# EasyEDA Pro project ProPrj_STC8H8K64U开发板_2024-06-28.epro

# Schematic Schematic1
Create Date: 2023-01-15; Page Name: P1; Project Name: STC8H8K64U; Schematic Name: Schematic1; Update Date: 2023-02-03; Company: 嘉立创EDA; Page Size: A3; Version: V1.0
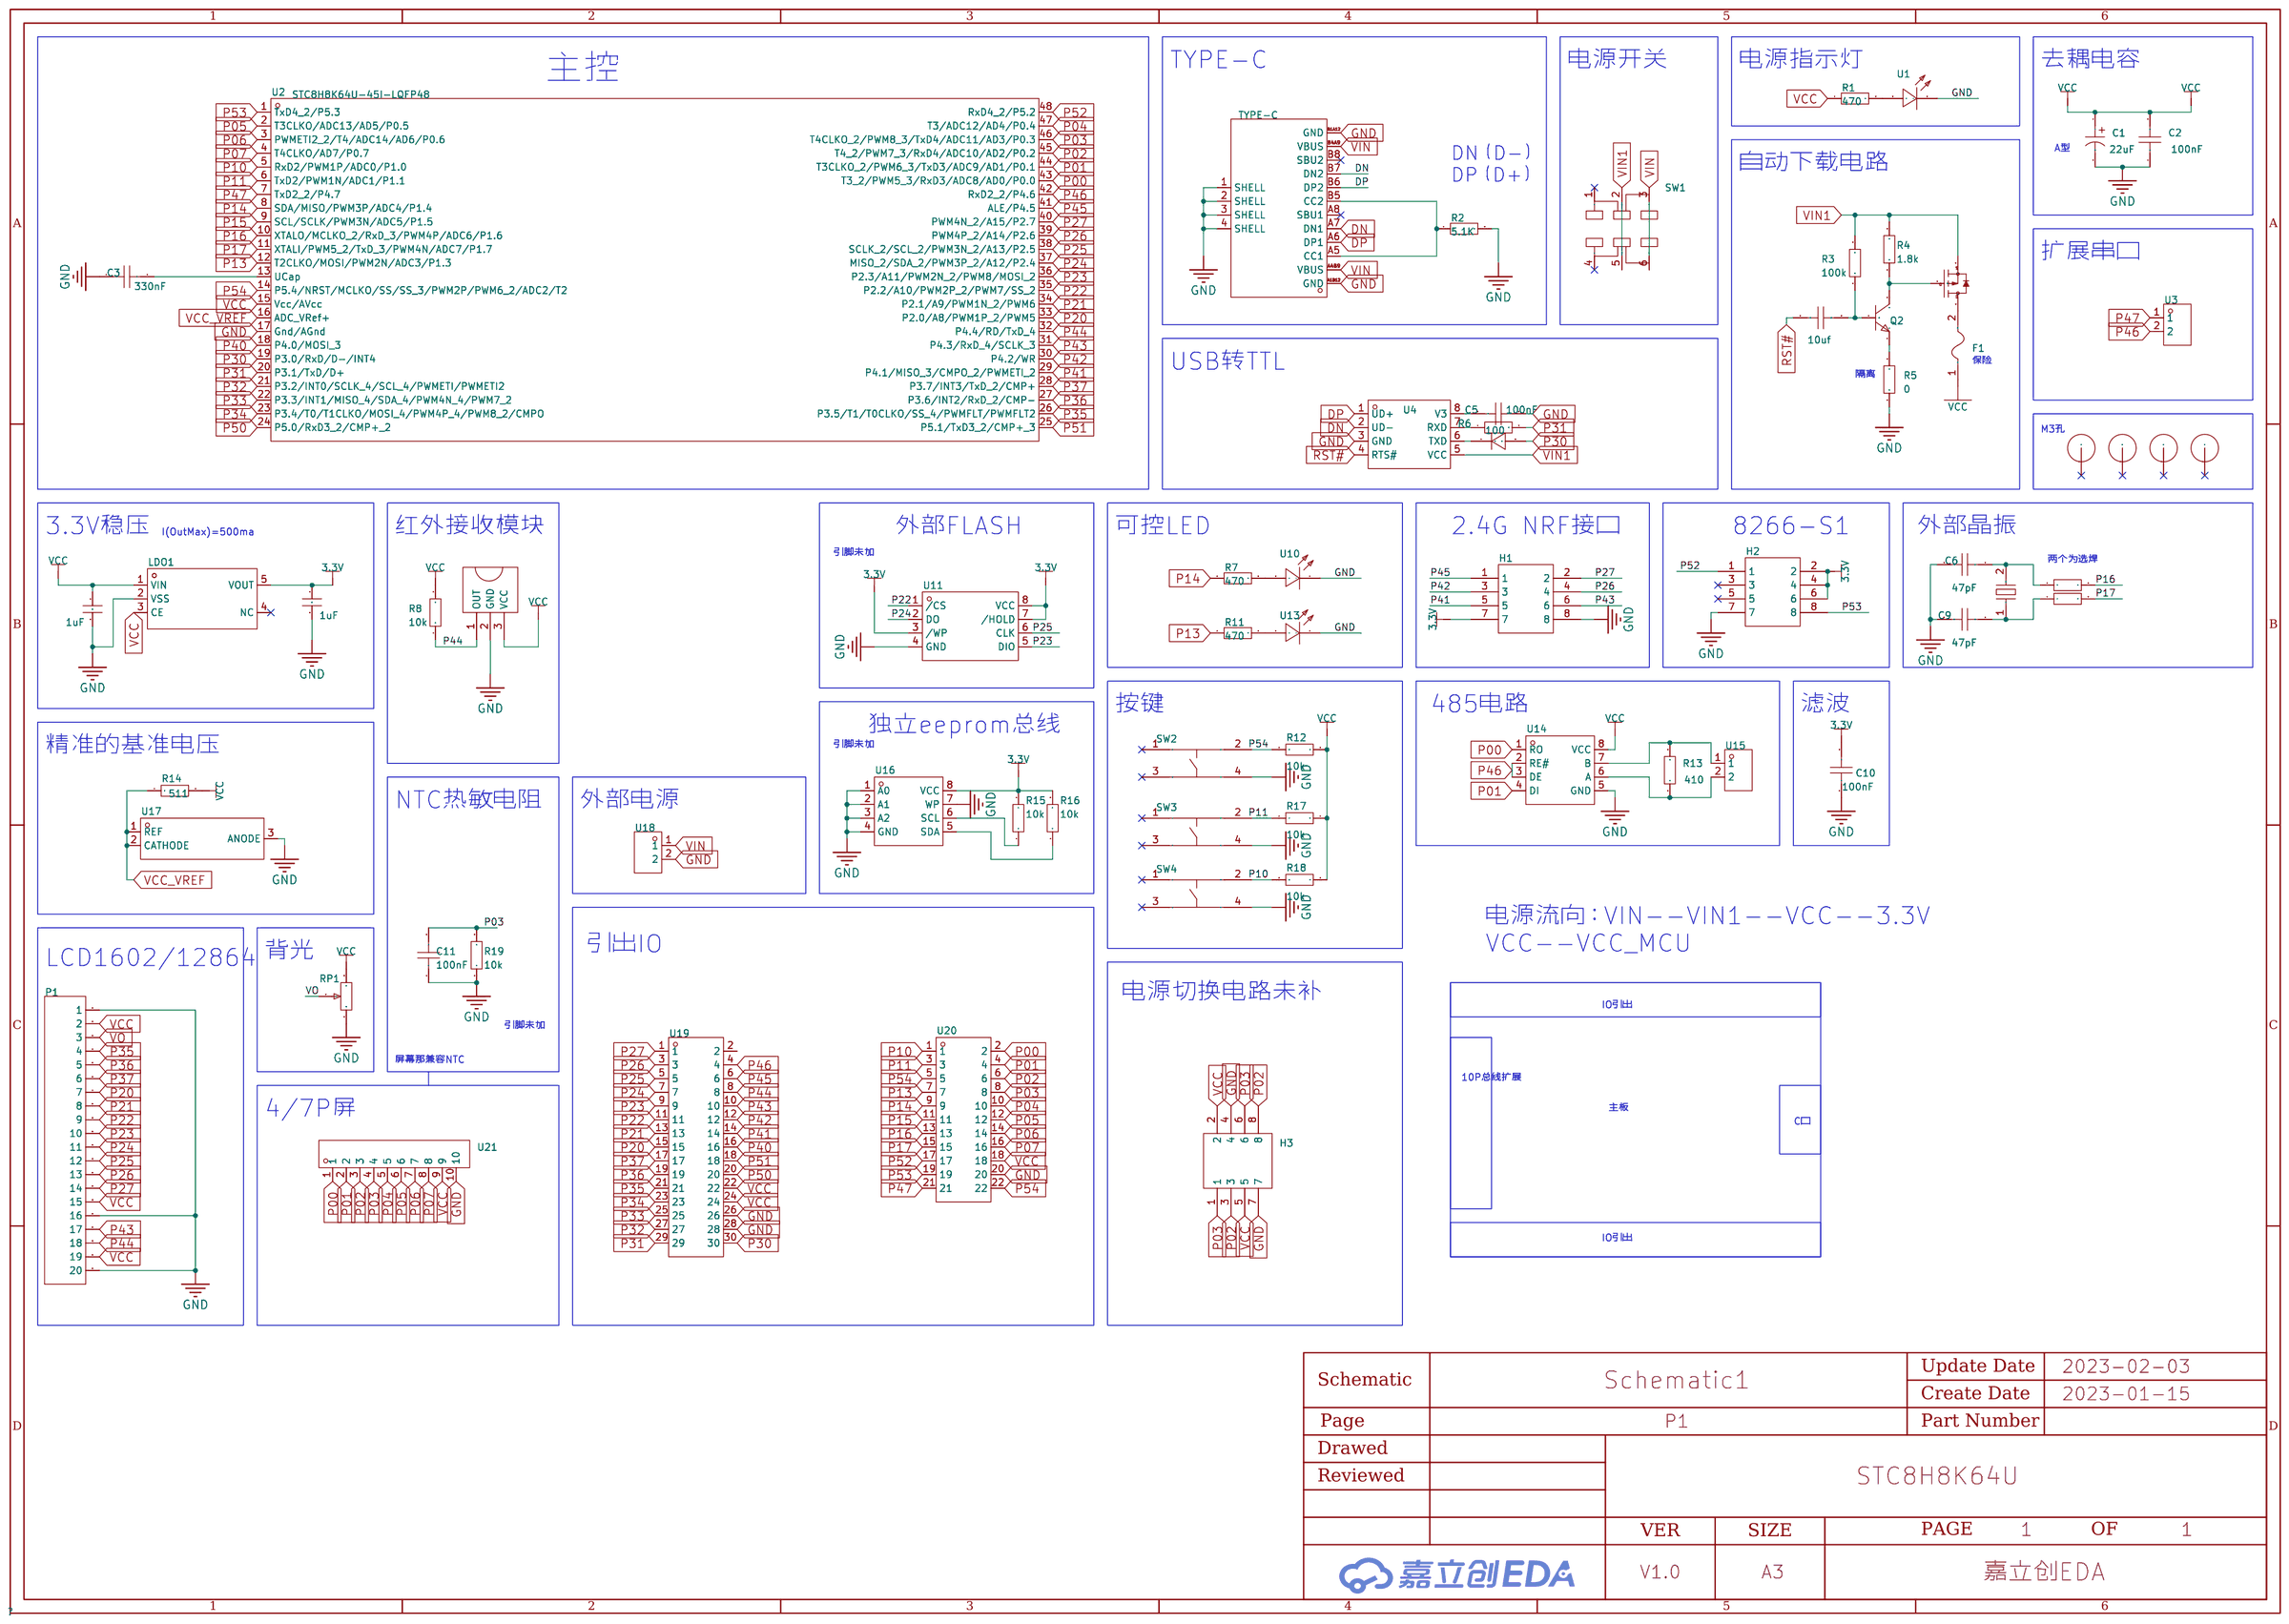
[diagram p0: schematic sheet]

## Parts
C1  22uF  [CAP-SMD_L3.2-W1.6]
C2  100nF  [C0603]
C3  330nF  [C0603]
C4  10uf  [C0805]
C5  100nF  [C0603]
C6  47pF  [C0603]
C7  1uF  [C0603]
C8  1uF  [C0603]
C9  47pF  [C0603]
C10  100nF  [C0603]
C11  100nF  [C0603]
D1  -  [SOD-123_L2.8-W1.8-LS3.7-RD]
F1  -  [F0805]
H1  A2541WV-2x4P  [HDR-TH_8P-P2.54-V-R2-C4-S2.54_A2541WV-2X4P]
H2  A2541WV-2x4P  [HDR-TH_8P-P2.54-V-R2-C4-S2.54_A2541WV-2X4P]
H3  A2541WV-2x4P  [HDR-TH_8P-P2.54-V-R2-C4-S2.54_A2541WV-2X4P]
LDO1  ME6211C33M5G-N  [SOT-23-5_L3.0-W1.7-P0.95-LS2.8-BR]
P1  2.54-1*20P母  [HDR-TH_20P-P2.54-V-F]
Q1  -  [SOT-23-3_L2.9-W1.3-P0.95-LS2.4-BR]
Q2  -  [SS8050-Y1]
R1  470  [R0603]
R2  5.1K  [R0603]
R3  100k  [R0603]
R4  1.8k  [R0603]
R5  0  [R0603]
R6  100  [R0603]
R7  470  [R0603]
R8  10k  [R0603]
R9  0  [R0603]
R10  0  [R0603]
R11  470  [R0603]
R12  10k  [R0603]
R13  410  [R0603]
R14  511  [R0603]
R15  10k  [R0603]
R16  10k  [R0603]
R17  10k  [R0603]
R18  10k  [R0603]
R19  10k  [R0603]
RP1  3X3贴片可调电阻10K可调(贴片可调电阻10K3X3EVM3GSX50B1410k±20%松下)  [RES-ADJ-SMD_3P-L3.0-W3.8-P1.75-BR]
SW1  MSK22D18G2 125  [SW-TH_SHOU_MSK22D18G2]
SW2  PTS810SJM250SMTRLFS  [KEY-SMD_4P-L4.2-W3.2-P2.20-LS4.6]
SW3  PTS810SJM250SMTRLFS  [KEY-SMD_4P-L4.2-W3.2-P2.20-LS4.6]
SW4  PTS810SJM250SMTRLFS  [KEY-SMD_4P-L4.2-W3.2-P2.20-LS4.6]
U1  LTE-C9901-GD  [LED0603-RD]
U2  STC8H8K64U-45I-LQFP48  [LQFP-48_L7.0-W7.0-P0.50-LS9.0-BL]
U3  XH2.54-WI-2P  [CONN-TH_XH2.54-WI-2P]
U4  -  [SOP-8_L5.0-W4.0-P1.27-LS6.0-BL]
U5  -  [M3]
U6  -  [M3]
U7  -  [M3]
U8  -  [M3]
U9  HS0038B  [OPTO-TH_HS0038B-A]
U10  LTE-C9901-GD  [LED0603-RD]
U11  W25X16贴片芯片  [SOP-8_L5.3-W5.2-P1.27-LS7.9-BL]
U12  32.768K/12.5PF  [CRYSTAL-SMD_L3.2-W1.5-1]
U13  LTE-C9901-GD  [LED0603-RD]
U14  SP3485EN-L/TR  [SOIC-8_L5.0-W4.0-P1.27-LS6.0-BL]
U15  XH2.54-WI-2P  [CONN-TH_XH2.54-WI-2P]
U16  24C02  [SOP-8_L4.9-W3.9-P1.27-LS6.0-BL]
U17  TL431  [SOT-23-3_L2.9-W1.3-P1.90-LS2.4-BR]
U18  XH2.54-WI-2P  [CONN-TH_XH2.54-WI-2P]
U19  COM2X15_2.54_DIP  [HDR-TH_30P-P2.54-V-M-R2-C15-S2.54]
U20  A2541HWV-2x11P  [HDR-TH_22P-P2.54-V-F-R2-C11-S2.54]
U21  cn10_2r54_10x1  [HDR-TH_10P-P2.54-V-F]
USB1  TYPE-C  [USB-C-SMD_TYPE-C16PIN]

## Library data of the parts
C1 = CA45-A-16V-22uF-K: 容值:22uF;精度:±10%;额定电压:16V;等效串联电阻:6Ω@100kHz;工作温度:-55℃~+125℃;; LCSC Part Name: 22uF ±10% 16V; Supplier Part: C782264; Manufacturer: CEC(振华新云); Supplier Footprint: CASE-A_3216; JLCPCB Part Class: 扩展库; Datasheet: https://atta.szlcsc.com/upload/public/pdf/source/20200909/C782264_D6D9C4EF3B25E81633C26A9294FBB820.pdf; Supplier: LCSC; Tolerance: ±10%; Rated Voltage: 16V; Equivalent Series Resistance(ESR): 6Ω@100kHz; Operating Temperature: -55℃~+125℃
C2 C5-C11 = C0603: 容值:330nF;精度:±5%;额定电压:16V;材质(温度系数):X7R;; LCSC Part Name: 330nF ±5% 16V; Supplier Part: C141102; Manufacturer: KEMET(基美); Manufacturer Part: C0603C334J4RAC7867; Supplier Footprint: 0603; JLCPCB Part Class: 扩展库; Datasheet: https://atta.szlcsc.com/upload/public/pdf/source/20180607/C141102_7AC54A82CBAFBF2B4A0A3FE033B0CF4C.pdf; Supplier: LCSC; Tolerance: ±5%; Voltage Rated: 16V; Temperature Coefficient: X7R
C3 = C0603C334J4RAC7867: 容值:330nF;精度:±5%;额定电压:16V;材质(温度系数):X7R;; LCSC Part Name: 330nF ±5% 16V; Supplier Part: C141102; Manufacturer: KEMET(基美); Supplier Footprint: 0603; JLCPCB Part Class: Extended Part; Datasheet: https://atta.szlcsc.com/upload/public/pdf/source/20180607/C141102_7AC54A82CBAFBF2B4A0A3FE033B0CF4C.pdf; Supplier: LCSC; Tolerance: ±5%; Voltage Rated: 16V; Temperature Coefficient: X7R
C4 = C0805
D1 = 1N4148W-TP: 二极管配置:-;功率:400mW;直流反向耐压(Vr):100V;平均整流电流(Io):150mA;正向压降(Vf):1.25V@150mA;反向电流(Ir):1A@75V;反向恢复时间(trr):4ns;工作温度:-65~+150@(Tj);; LCSC Part Name: 100V 150mA 4ns; Supplier Part: C77978; Manufacturer: MCC(美微科); Supplier Footprint: SOD-123; JLCPCB Part Class: Extended Part; Datasheet: https://atta.szlcsc.com/upload/public/pdf/source/20161112/1478931639357.pdf; Supplier: LCSC; Power Dissipation: 400mW; Reverse Voltage (Vr): 100V; Average Rectified Current (Io): 150mA; Forward Voltage (Vf@If): 1.25V@150mA; Reverse Leakage Current: 1A@75V; Reverse Recovery Time (trr): 4ns; Operating Temperature: -65~+150@(Tj)
F1 = JK-SMD0805-050/6V: 最大电压:6V;最大电流:100A;保持电流:500mA;跳闸电流:1A;消耗功率:600mW;初始态阻值(最小值):150mΩ;跳断后阻值(最大值):850mΩ;最大动作时间:0.1s;工作温度:-40~+85;; LCSC Part Name: 500mA 6V; Supplier Part: C2830231; Manufacturer: JK(金科); Supplier Footprint: 0805; JLCPCB Part Class: Extended Part; Datasheet: https://atta.szlcsc.com/upload/public/pdf/source/20210427/C2830234_9CFD1315ED734F12B51A8F5CDEC96010.pdf; Supplier: LCSC; Operating Voltage (Max): 6V; Current Rating (Max): 100A; Hold Current: 500mA; Trip Current: 1A; Power Dissipation: 600mW; Resistance - Initial (Ri) (Min): 150mΩ; Resistance - Post Trip (R1) (Max): 850mΩ; Maximum Time to Trip: 0.1s; Operating Temperature: -40~+85
H1-H3 = A2541WV-2x4P: 排数:双排;总PIN位数:8;间距:2.54mm;插针结构:2x4P;行距:2.54mm;安装类型:直插;圆针/方针:方针;额定电流:-;额定电压:-;配合针长度:6mm;塑高:2.54mm;端接针长度:3mm;触头材质:黄铜;触头镀层:-;工作温度范围:-40℃~+105℃;颜色:黑色;; LCSC Part Name: 2.54mm 2x4P 直插 方针 镀金; Supplier Part: C225519; Manufacturer: CJT(长江连接器); Supplier Footprint: 插件,P=2.54mm; JLCPCB Part Class: 扩展库; Datasheet: https://atta.szlcsc.com/upload/public/pdf/source/20180509/C225519_93746B99266AA550760B05B3359A404E.pdf; Supplier: LCSC; Number of Rows: 双排; Number of Pins: 8; Pitch: 2.54mm; Pin Structure: 2x4P; Row Spacing: 2.54mm; Mounting Type: 直插; Circluar Pins/Square Pins: 方针; Length of Mating Pin: 6mm; Insulation Height: 2.54mm; Length of End Connection Pin: 3mm; Contact Material: 黄铜; Operating Temperature Range: -40℃~+105℃; Color: 黑色
LDO1 = ME6211C33M5G-N: 输出类型:固定;输出极性:正;输出通道数:1;最大输入电压:6V;输出电压:3.3V;压差:260mV@(200mA);输出电流:500mA;电源纹波抑制比(PRSS):70dB@(1kHz),62dB@(10kHz);; LCSC Part Name: Vin=6V Vout=3.3V 500mA 70dB@(1kHz),62dB@(10kHz); Supplier Part: C82942; Manufacturer: MICRONE(南京微盟); Supplier Footprint: SOT-23-5; JLCPCB Part Class: 扩展库; Datasheet: https://atta.szlcsc.com/upload/public/pdf/source/20170918/C82942_1505727073070976520.pdf; Supplier: LCSC; Output Type: 固定; Output Polarity: 正; Number of Outputs: 1; Maximum Input Voltage: 6V; Output Voltage: 3.3V; Dropout Voltage: 260mV@(200mA); Output Current: 500mA; Power Supply Rejection Ratio (PRSS): 70dB@(1kHz),62dB@(10kHz)
P1 = 2.54-1*20P母: 排数:单排;总孔位数:20;间距:2.54mm;插孔结构:1x20P;行距:-;安装类型:直插;塑高:-;触头材质:-;触头镀层:-;; LCSC Part Name: 2.54mm 1x20P; Supplier Part: C50984; Manufacturer: BOOMELE(博穆精密); Supplier Footprint: 插件,P=2.54mm; JLCPCB Part Class: 扩展库; Datasheet: https://atta.szlcsc.com/upload/public/pdf/source/20151109/1457707571590.pdf; Supplier: LCSC; Number of Rows: 单排; Number of Holes: 20; Pitch: 2.54mm; Holes Structure: 1x20P; Mounting Type: 直插
Q1 = AO3401: Supplier Part: C2985640; Manufacturer: KUU; Supplier Footprint: SOT-23; Datasheet: https://atta.szlcsc.com/upload/public/pdf/source/20220328/37BE275F20EB9DF71D2647772B9E905B.pdf; Supplier: LCSC
Q2 = SS8050-Y1
R1-R19 = R0603: 阻值:680kΩ;精度:±5%;功率:100mW;温度系数:±100ppm/℃;最大工作电压:75V;工作温度范围:-55℃~+155℃;; LCSC Part Name: 680kΩ ±5% 100mW; Supplier Part: C141272; Manufacturer: YAGEO(国巨); Manufacturer Part: RC0603JR-07680KL; Supplier Footprint: 0603; JLCPCB Part Class: 扩展库; Datasheet: https://atta.szlcsc.com/upload/public/pdf/source/20171107/C141272_15100520737541097311.pdf; Supplier: LCSC; Tolerance: ±5%; Power(Watts): 100mW; Temperature Coefficient: ±100ppm/℃; Overload Voltage (Max): 75V; Operating Temperature Range: -55℃~+155℃
RP1 = 3X3贴片可调电阻10K可调(贴片可调电阻10K3X3EVM3GSX50B1410k±20%松下): Supplier Part: C9900002171; Supplier Footprint: SMD-3; JLCPCB Part Class: 扩展库; Datasheet: https://atta.szlcsc.comnull; Supplier: LCSC
SW1 = MSK22D18G2 125: 额定电流(DC):100mA;额定电压(DC):12V;电路结构:双刀双掷;安装方式:卧插;机械寿命:10000;开关颜色:黑色;引脚样式:PC引脚;工作温度:-25~+70;; LCSC Part Name: 拨动开关/两档侧式 6脚插件 柄长2.0mm 大六侧插 9.1*3.5mm; Supplier Part: C2906279; Manufacturer: SHOU HAN(首韩); Supplier Footprint: 插件; JLCPCB Part Class: 扩展库; Datasheet: https://atta.szlcsc.com/upload/public/pdf/source/20211019/36E67B52668D9BCD1B973B992274E152.pdf; Supplier: LCSC; Current Rating (DC): 100mA; Voltage Rating (DC): 12V; Circuit: 双刀双掷; Mounting Style: 卧插; Mechanical Life: 10000; Actuator Color: 黑色; Pin Style: PC引脚; Operating Temperature: -25~+70
SW2-SW4 = PTS810SJM250SMTRLFS: 触点电流:50mA;额定电压(DC):16V;电路结构:单刀单掷;按钮作用方向:顶部触动;致动器样式:圆形按钮;照明颜色:-;开关长度:4.2mm;开关宽度:3.2mm;开关高度:2.5mm;; Supplier Part: C116501; Manufacturer: C&K; Supplier Footprint: SMD; JLCPCB Part Class: 扩展库; Datasheet: https://atta.szlcsc.com/upload/public/pdf/source/20180704/C116501_199B7AD0EF93D1F69D47FA53D559C299.pdf; Supplier: LCSC; Contact Current: 50mA; Voltage Rating (DC): 16V; Circuit: 单刀单掷; Actuator Orientation: 顶部触动; Actuator Style: 圆形按钮; Switch Length: 4.2mm; Switch Width: 3.2mm; Switch Height: 2.5mm
U1 U10 U13 = LED0603: Supplier Part: C9900001446; JLCPCB Part Class: 扩展库; Datasheet: 2021-11-05/656770A/ba22942e39c442c6b9c95335d512e62d/LTE-C9901-GD.pdf; Supplier: LCSC
U2 = STC8H8K64U-45I-LQFP48: 高精准12位ADC; Supplier Part: C3013145; Manufacturer: STC(宏晶); Supplier Footprint: LQFP48; JLCPCB Part Class: 扩展库; Datasheet: https://atta.szlcsc.com/upload/public/pdf/source/20221115/27017C7225B6A84DF1BF73428956C9B9.pdf; Supplier: LCSC
U3 U15 U18 = XH2.54-WI-2P: Supplier Part: C9900005527; Supplier Footprint: XH2.54MM-2P; JLCPCB Part Class: 扩展库; Supplier: LCSC
U4 = CH340N: Supplier Part: C506813; Manufacturer: WCH(南京沁恒); Supplier Footprint: SOP-8; Datasheet: https://atta.szlcsc.com/upload/public/pdf/source/20200819/C84681_ADBED554CE321879DBD6B1D06488689C.pdf; Supplier: LCSC; JLCPCB Part Class: Extended Part
U5-U8 = M3
U9 = HS0038B: Supplier Part: C9900001501; Supplier Footprint: DIP-3; JLCPCB Part Class: 扩展库; Datasheet: 2021-11-06/848019G/9d0c8d3ebb7f4498b21a2c16cf887121/HS0038B.pdf; Supplier: LCSC
U11 = W25X16贴片芯片: Supplier Part: C9900007845; Supplier Footprint: SOP-8; JLCPCB Part Class: 扩展库; Datasheet: https://atta.szlcsc.comnull; Supplier: LCSC
U12 = 32.768K/12.5PF: Supplier Part: C9900014970; Supplier Footprint: 32.768KHz; JLCPCB Part Class: 扩展库; Datasheet: https://atta.szlcsc.comnull; Supplier: LCSC
U14 = SP3485EN-L/TR: 类型:收发器;驱动器/接收器:1/1;数据速率:10Mbps;电源电压:3.3V;; LCSC Part Name: 10Mbps; Supplier Part: C8963; Manufacturer: MaxLinear; Supplier Footprint: SOIC-8-150mil; JLCPCB Part Class: 基础库; Datasheet: https://atta.szlcsc.com/upload/public/pdf/source/20170601/1496285796963.pdf; Supplier: LCSC; Types: 收发器; Driver/receiver: 1/1; Data Rate: 10Mbps; Supply Voltage: 3.3V
U16 = 24C02: Supplier Part: C2984961; Manufacturer: HX(恒佳兴); Supplier Footprint: SOP-8; JLCPCB Part Class: 扩展库; Datasheet: https://atta.szlcsc.com/upload/public/pdf/source/20220328/EEDD5B560A30EF54D50A97B6296179D0.pdf; Supplier: LCSC
U17 = TL431: Supplier Part: C2887585; Manufacturer: YFSEMI(江苏佑风微); Supplier Footprint: SOT-23; JLCPCB Part Class: 扩展库; Datasheet: https://atta.szlcsc.com/upload/public/pdf/source/20211230/94EA76606731071F336A0C78CD912A4F.pdf; Supplier: LCSC
U19 = COM2X15_2.54_DIP: Supplier Part: C9900027096; Supplier Footprint: 2X15PIN2.54排针; JLCPCB Part Class: 扩展库; Datasheet: https://atta.szlcsc.comnull; Supplier: LCSC
U20 = A2541HWV-2x11P_1: LCSC Part Name: 2.54mm 2x11P; Supplier Part: C5340510; Manufacturer: CJT(长江连接器); Supplier Footprint: 插件,P=2.54mm; Supplier: LCSC
U21 = cn10_2r54_10x1: Supplier Part: C9900001415; JLCPCB Part Class: 扩展库; Datasheet: https://atta.szlcsc.comnull; Supplier: LCSC
USB1 = TYPEC12PINCONN: Supplier Part: C9900004950; Supplier Footprint: TYPE-C16PIN母座; JLCPCB Part Class: Extended Part; Supplier: LCSC

## Nets
3.3V: C8.2 C10.2 H1.7 H2.2 H2.4 H2.6 LDO1.5(VOUT) R15.2 R16.2 U11.3(/WP) U11.7(/HOLD) U11.8(VCC) U16.8(VCC)
GND: C1.2 C2.1 C3.1 C5.1 C6.2 C7.1 C8.1 C9.2 C10.1 C11.1 H1.8 H2.7 H3.4 H3.7 LDO1.2(VSS) P1.1 P1.16 P1.20 R2.2 R5.1 R19.1 RP1.1 SW2.4 SW3.4 SW4.4 U1.1(-) U2.17(Gnd/AGnd) U4.3(GND) U9.2(GND) U10.1(-) U11.4(GND) U13.1(-) U14.5(GND) U16.1(A0) U16.2(A1) U16.3(A2) U16.4(GND) U16.7(WP) U17.3(ANODE) U18.2 U19.26 U19.28 U20.20 U21.10 USB1.1(SHELL) USB1.2(SHELL) USB1.3(SHELL) USB1.4(SHELL) USB1.A1B12(GND) USB1.B1A12(GND)
VCC: C1.1 C2.2 C7.2 F1.1 H3.2 H3.5 LDO1.1(VIN) LDO1.3(CE) P1.2 P1.15 P1.19 R1.1 R8.2 R12.2 R14.2 R17.2 R18.2 RP1.3 U2.15(Vcc/AVcc) U9.3(VCC) U14.8(VCC) U19.22 U19.24 U20.18 U21.9
VCC_VREF: R14.1 U2.16(ADC_VRef+) U17.1(REF) U17.2(CATHODE)
VIN: SW1.3 U18.1 USB1.A4B9(VBUS) USB1.B4A9(VBUS)
VIN1: Q1.2(S) R3.2 R4.2 SW1.2 U4.5(VCC)
DN: U4.2(UD-) USB1.A7(DN1) USB1.B7(DN2)
DP: U4.1(UD+) USB1.A6(DP1) USB1.B6(DP2)
P00: U2.43(T3_2/PWM5_3/RxD3/ADC8/AD0/P0.0) U14.1(RO) U20.2 U21.1
P01: U2.44(T3CLKO_2/PWM6_3/TxD3/ADC9/AD1/P0.1) U14.4(DI) U20.4 U21.2
P02: H3.3 H3.8 U2.45(T4_2/PWM7_3/RxD4/ADC10/AD2/P0.2) U20.6 U21.3
P03: C11.2 H3.1 H3.6 R19.2 U2.46(T4CLKO_2/PWM8_3/TxD4/ADC11/AD3/P0.3) U20.8 U21.4
P04: U2.47(T3/ADC12/AD4/P0.4) U20.10 U21.5
P05: U2.2(T3CLKO/ADC13/AD5/P0.5) U20.12 U21.6
P06: U2.3(PWMETI2_2/T4/ADC14/AD6/P0.6) U20.14 U21.7
P07: U2.4(T4CLKO/AD7/P0.7) U20.16 U21.8
P10: R18.1 SW4.2 U2.5(RxD2/PWM1P/ADC0/P1.0) U20.1
P11: R17.1 SW3.2 U2.6(TxD2/PWM1N/ADC1/P1.1) U20.3
P13: R11.1 U2.12(T2CLKO/MOSI/PWM2N/ADC3/P1.3) U20.7
P14: R7.1 U2.8(SDA/MISO/PWM3P/ADC4/P1.4) U20.9
P15: U2.9(SCL/SCLK/PWM3N/ADC5/P1.5) U20.11
P16: R9.2 U2.10(XTALO/MCLKO_2/RxD_3/PWM4P/ADC6/P1.6) U20.13
P17: R10.2 U2.11(XTALI/PWM5_2/TxD_3/PWM4N/ADC7/P1.7) U20.15
P20: P1.7 U2.33(P2.0/A8/PWM1P_2/PWM5) U19.15
P21: P1.8 U2.34(P2.1/A9/PWM1N_2/PWM6) U19.13
P22: P1.9 U2.35(P2.2/A10/PWM2P_2/PWM7/SS_2) U11.1(/CS) U19.11
P23: P1.10 U2.36(P2.3/A11/PWM2N_2/PWM8/MOSI_2) U11.5(DIO) U19.9
P24: P1.11 U2.37(MISO_2/SDA_2/PWM3P_2/A12/P2.4) U11.2(DO) U19.7
P25: P1.12 U2.38(SCLK_2/SCL_2/PWM3N_2/A13/P2.5) U11.6(CLK) U19.5
P26: H1.4 P1.13 U2.39(PWM4P_2/A14/P2.6) U19.3
P27: H1.2 P1.14 U2.40(PWM4N_2/A15/P2.7) U19.1
P30: D1.2(A) U2.19(P3.0/RxD/D-/INT4) U19.30
P31: R6.2 U2.20(P3.1/TxD/D+) U19.29
P32: U2.21(P3.2/INT0/SCLK_4/SCL_4/PWMETI/PWMETI2) U19.27
P33: U2.22(P3.3/INT1/MISO_4/SDA_4/PWM4N_4/PWM7_2) U19.25
P34: U2.23(P3.4/T0/T1CLKO/MOSI_4/PWM4P_4/PWM8_2/CMPO) U19.23
P35: P1.4 U2.26(P3.5/T1/T0CLKO/SS_4/PWMFLT/PWMFLT2) U19.21
P36: P1.5 U2.27(P3.6/INT2/RxD_2/CMP-) U19.19
P37: P1.6 U2.28(P3.7/INT3/TxD_2/CMP+) U19.17
P40: U2.18(P4.0/MOSI_3) U19.16
P41: H1.5 U2.29(P4.1/MISO_3/CMPO_2/PWMETI_2) U19.14
P42: H1.3 U2.30(P4.2/WR) U19.12
P43: H1.6 P1.17 U2.31(P4.3/RxD_4/SCLK_3) U19.10
P44: P1.18 R8.1 U2.32(P4.4/RD/TxD_4) U9.1(OUT) U19.8
P45: H1.1 U2.41(ALE/P4.5) U19.6
P46: U2.42(RxD2_2/P4.6) U3.2 U14.2(RE#) U14.3(DE) U19.4
P47: U2.7(TxD2_2/P4.7) U3.1 U20.21
P50: U2.24(P5.0/RxD3_2/CMP+_2) U19.20
P51: U2.25(P5.1/TxD3_2/CMP+_3) U19.18
P52: H2.1 U2.48(RxD4_2/P5.2) U20.17
P53: H2.8 U2.1(TxD4_2/P5.3) U20.19
P54: R12.1 SW2.2 U2.14(P5.4/NRST/MCLKO/SS/SS_3/PWM2P/PWM6_2/ADC2/T2) U20.5 U20.22
RST#: C4.1 U4.4(RTS#)
VO: P1.3 RP1.2
$1N2753: R2.1 USB1.A5(CC1) USB1.B5(CC2)
$1N3432: C4.2 Q2.1(B) R3.1
$1N3434: Q1.1(G) Q2.3(C) R4.1
$1N3437: F1.2 Q1.3(D)
Net-(C3-2): C3.2 U2.13(UCap)
Net-(C5-2): C5.2 U4.8(V3)
Net-(C6-1): C6.1 R9.1 U12.2
Net-(C9-1): C9.1 R10.1 U12.1
Net-(D1-1): D1.1(c) U4.6(TXD)
Net-(Q2-2): Q2.2(E) R5.2
Net-(R1-2): R1.2 U1.2(+)
Net-(R6-1): R6.1 U4.7(RXD)
Net-(R7-2): R7.2 U10.2(+)
Net-(R11-2): R11.2 U13.2(+)
Net-(R13-1): R13.1 U14.6(A) U15.2
Net-(R13-2): R13.2 U14.7(B) U15.1
Net-(R15-1): R15.1 U16.6(SCL)
Net-(R16-1): R16.1 U16.5(SDA)

Not connected (* = marked no-connect by the designer): H2 3* 5*; LDO1 4(NC)*; SW1 1* 4* 5 6; SW2 1* 3*; SW3 1* 3*; SW4 1* 3*; U5 1*; U6 1*; U7 1*; U8 1*; U19 2; USB1 A8(SBU1)* B8(SBU2)*

## Notes on the sheet
- TYPE-C
- 电源开关
- 电源指示灯
- 去耦电容
- 主控
- DN（D-）
  DP（D+）
- A型
- 自动下载电路
- 扩展串口
- USB转TTL
- 保险
- 隔离
- M3孔
- 3.3V稳压
- I(OutMax)=500ma
- 红外接收模块
- 外部FLASH
- 可控LED
- 2.4G NRF接口
- 8266-S1
- 外部晶振
- 引脚未加
- 两个为选焊
- 按键
- 485电路
- 滤波
- 独立eeprom总线
- 精准的基准电压
- 引脚未加
- NTC热敏电阻
- 外部电源
- 电源流向：VIN--VIN1--VCC--3.3V
  VCC--VCC_MCU
- 引出IO
- LCD1602/12864
- 背光
- 电源切换电路未补
- IO引出
- 引脚未加
- 屏幕那兼容NTC
- 10P总线扩展
- 主板
- 4/7P屏
- C口
- IO引出

# Board PCB1
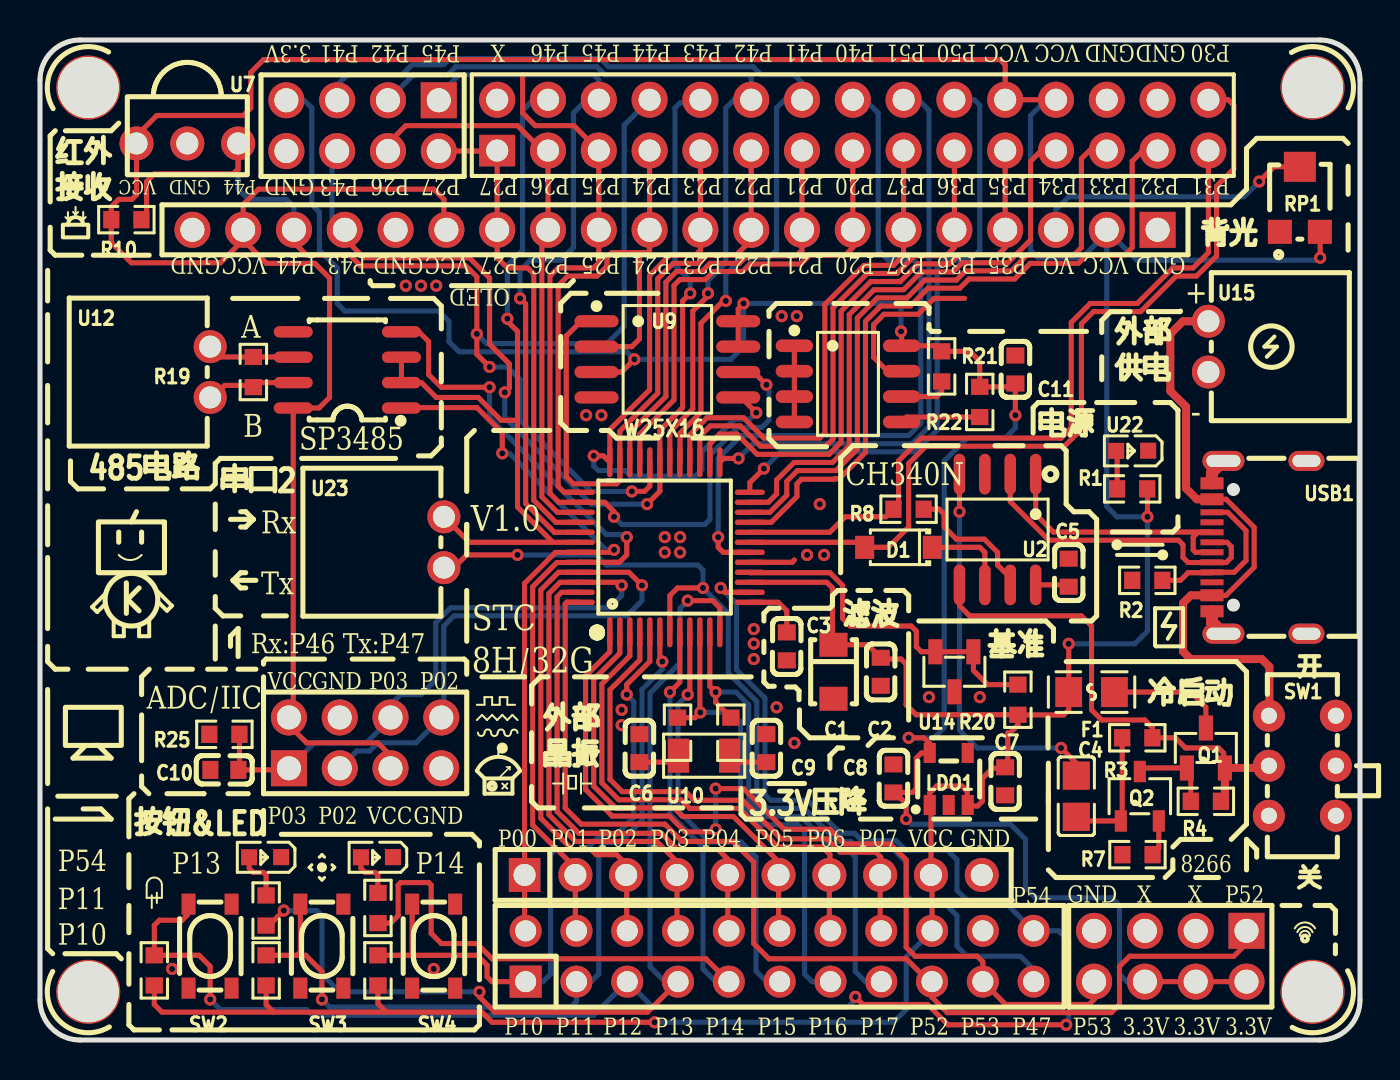
[diagram p1: board, top side]
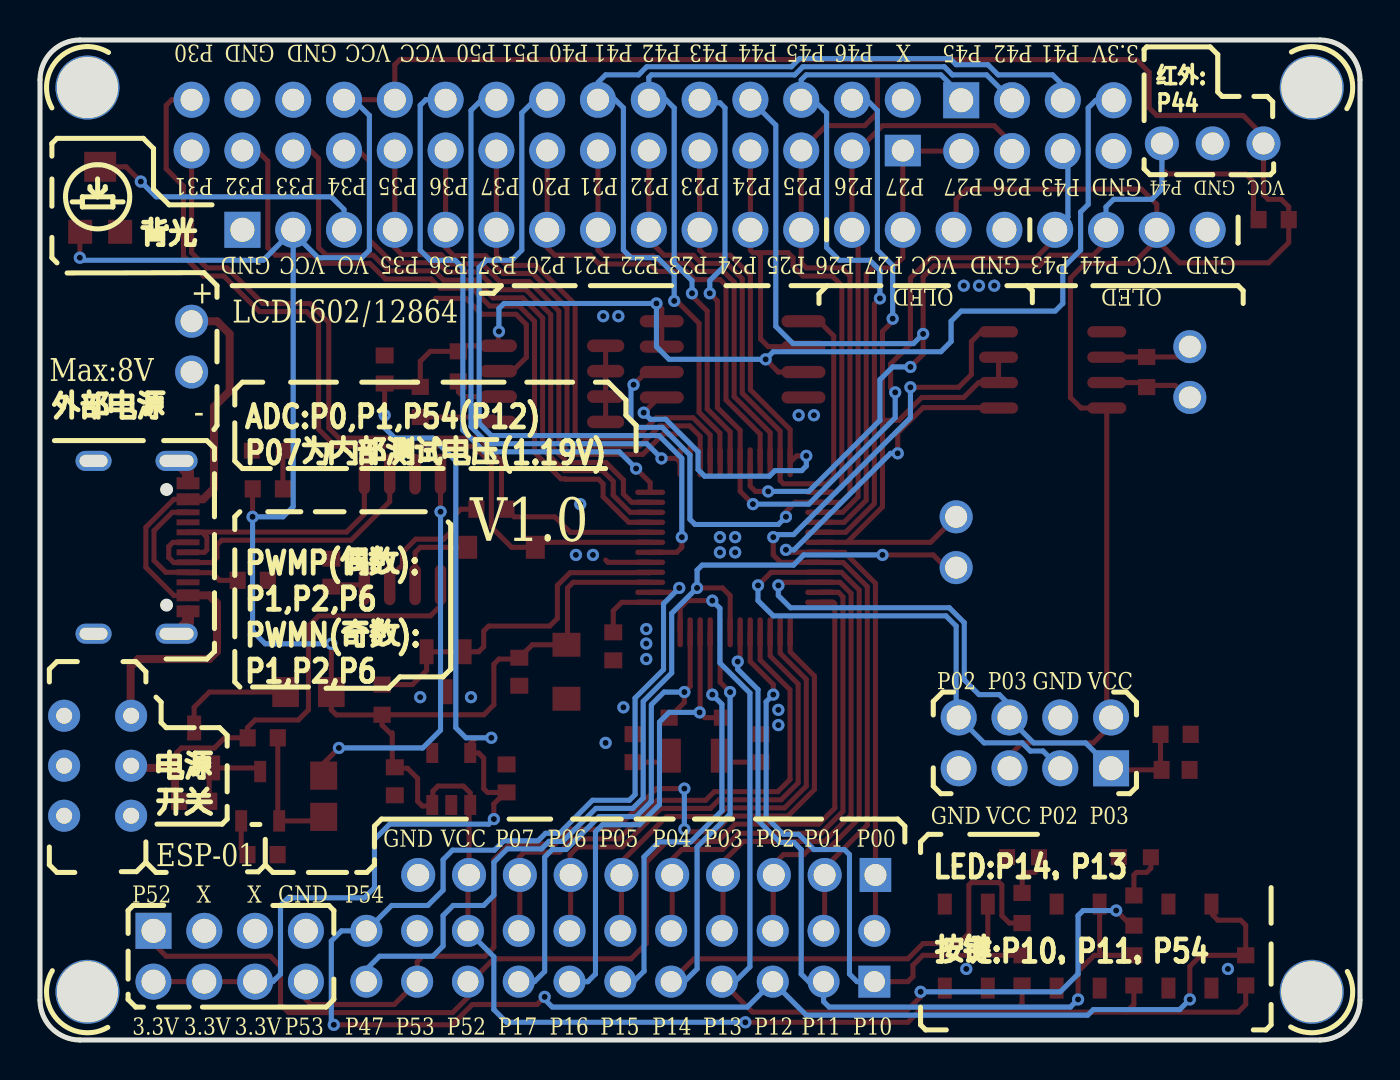
[diagram p2: board, bottom side, seen from below]

Outline 66 x 50 mm; copper layers: Top Layer, Bottom Layer. Coordinates in mm from the lower left corner of the outline.
Outline path: 0,48 0,2 arc(0.59,0.59) 2,0 64,0 arc(65.41,0.59) 66,2 66,48 arc(65.41,49.41) 64,50 2,50 arc(0.59,49.41) 0,48
Stack: Top Layer 0.035mm / Dielectric1 1.51mm FR4 er 4.5 / Bottom Layer 0.035mm

## Design rules (mm)
spacing safeClearance (default): track to track 0.152, other pairs 0.152 to 0.3
track width trackWidth (default): min 0.127, default 0.254, max 2.54
differential pair differentialPair (default): width min 0.127, default 0.254, max 2.54; gap min 0.152, default 0.152
via viaSize (default): diameter min 0.5, default 0.61, max 10; hole min 0.3, default 0.305, max 6

## Placement (name value [footprint] x y rotation side)
C1  22uF  [CAP-SMD_L3.2-W1.6]  39.68 18.41 270 top
C2  100nF  [C0603]  42.04 18.41 90 top
C3  330nF  [C0603]  37.34 19.68 90 top
C4  10uf  [C0805]  51.82 12.19 270 top
C5  100nF  [C0603]  51.44 23.36 270 top
C6  47pF  [C0603]  29.97 14.59 90 top
C7  1uF  [C0603]  48.26 12.94 90 top
C8  1uF  [C0603]  42.67 13.08 270 top
C9  47pF  [C0603]  36.32 14.59 90 top
C10  100nF  [C0603]  9.22 13.51 0 top
C11  100nF  [C0603]  48.77 33.52 270 top
D1  -  [SOD-123_L2.8-W1.8-LS3.7-RD]  42.93 24.63 180 top
F1  -  [F0805]  52.58 17.4 0 top
H1  A2541WV-2x4P  [HDR-TH_8P-P2.54-V-R2-C4-S2.54_A2541WV-2X4P]  16.13 45.72 180 top
H2  A2541WV-2x4P  [HDR-TH_8P-P2.54-V-R2-C4-S2.54_A2541WV-2X4P]  56.52 4.19 180 top
H3  A2541WV-2x4P  [HDR-TH_8P-P2.54-V-R2-C4-S2.54_A2541WV-2X4P]  16.26 14.86 0 top
LDO1  ME6211C33M5G-N  [SOT-23-5_L3.0-W1.7-P0.95-LS2.8-BR]  45.44 13.05 270 top
P1  2.54-1*20P母  [HDR-TH_20P-P2.54-V-F]  31.75 40.51 180 top
Q1  -  [SOT-23-3_L2.9-W1.3-P0.95-LS2.4-BR]  58.29 14.6 270 top
Q2  -  [SS8050-Y1]  54.99 12.19 270 top
R1  470  [R0603]  54.61 27.56 180 top
R2  5.1K  [R0603]  55.36 22.98 180 top
R3  100k  [R0603]  54.86 15.11 0 top
R4  1.8k  [R0603]  58.29 11.94 0 top
R7  470  [R0603]  54.87 9.27 0 top
R8  10k  [R0603]  43.43 26.54 180 top
R9  0  [R0603]  16.9 6.6 90 top
R10  0  [R0603]  4.32 41.02 180 top
R12  10k  [R0603]  31.88 15.36 90 top
R14  511  [R0603]  34.54 15.36 90 top
R16  10k  [R0603]  11.31 6.47 90 top
R18  10k  [R0603]  5.72 3.48 270 top
R19  10k  [R0603]  10.67 33.4 270 top
R20  511  [R0603]  48.89 17.02 270 top
R21  10k  [R0603]  45.08 33.68 90 top
R22  10k  [R0603]  46.99 31.9 90 top
R23  10k  [R0603]  11.31 3.48 270 top
R24  10k  [R0603]  16.9 3.48 270 top
R25  10k  [R0603]  9.22 15.28 0 top
RP1  3X3贴片可调电阻10K可调(贴片可调电阻10K3X3EVM3GSX50B1410k±20%松下)  [RES-ADJ-SMD_3P-L3.0-W3.8-P1.75-BR]  62.99 42.03 270 top
SW1  MSK22D18G2 125  [SW-TH_SHOU_MSK22D18G2]  63.12 13.71 90 top
SW2  PTS810SJM250SMTRLFS  [KEY-SMD_4P-L4.2-W3.2-P2.20-LS4.6]  8.5 4.7 90 top
SW3  PTS810SJM250SMTRLFS  [KEY-SMD_4P-L4.2-W3.2-P2.20-LS4.6]  14.09 4.7 90 top
SW4  PTS810SJM250SMTRLFS  [KEY-SMD_4P-L4.2-W3.2-P2.20-LS4.6]  19.69 4.7 90 top
U1  LTE-C9901-GD  [LQFP-48_L7.0-W7.0-P0.50-LS9.0-BL]  31.24 24.63 0 top
U2  STC8H8K64U-45I-LQFP48  [SOP-8_L5.0-W4.0-P1.27-LS6.0-BL]  47.88 25.52 180 top
U3  XH2.54-WI-2P  [M3]  2.54 47.62 90 top
U4  -  [M3]  63.63 47.49 0 top
U5  -  [M3]  2.41 2.28 0 top
U6  -  [M3]  63.5 2.41 270 top
U7  HS0038B  [OPTO-TH_HS0038B-A]  7.37 44.83 0 top
U9  HS0038B  [SOP-8_L5.3-W5.2-P1.27-LS7.9-BL]  31.37 34.03 270 top
U10  LTE-C9901-GD  [CRYSTAL-SMD_L3.2-W1.5-1]  33.21 14.22 180 top
U11  W25X16贴片芯片  [SOIC-8_L5.0-W4.0-P1.27-LS6.0-BL]  15.37 33.5 90 top
U12  32.768K/12.5PF  [CONN-TH_XH2.54-WI-2P]  8.51 33.4 90 top
U13  LTE-C9901-GD  [SOP-8_L4.9-W3.9-P1.27-LS6.0-BL]  40.4 32.81 270 top
U14  SP3485EN-L/TR  [SOT-23-3_L2.9-W1.3-P1.90-LS2.4-BR]  45.72 18.41 90 top
U15  XH2.54-WI-2P  [CONN-TH_XH2.54-WI-2P]  58.42 34.67 270 top
U16  24C02  [HDR-TH_30P-P2.54-V-M-R2-C15-S2.54]  40.64 45.74 0 top
U18  XH2.54-WI-2P  [HDR-TH_10P-P2.54-V-F]  35.66 8.25 0 top
U19  COM2X15_2.54_DIP  [HDR-TH_22P-P2.54-V-F-R2-C11-S2.54]  36.98 4.19 0 top
U20  A2541HWV-2x11P  [LED0603-RD]  16.85 9.14 180 top
U21  cn10_2r54_10x1  [LED0603-RD]  11.26 9.14 180 top
U22  LTE-C9901-GD  [LED0603-RD]  54.61 29.46 180 top
U23  XH2.54-WI-2P  [CONN-TH_XH2.54-WI-2P]  20.19 24.89 90 top
USB1  TYPE-C  [USB-C-SMD_TYPE-C16PIN]  60.96 24.63 90 top

## Footprints (pads in the part's own frame, mm; a bottom-side part is the same pattern mirrored in y, then rotated)
C0603
  rect 0.8x0.9 smd: 1(-0.7,0) 2(0.7,0)
C0805
  rect 1.409x1.351 smd: 1(-1.028,0) 2(1.031,0)
CAP-SMD_L3.2-W1.6
  rect 1.2x1.4 smd: 1(-1.35,0) 2(1.35,0)
CONN-TH_XH2.54-WI-2P
  round 1.65 hole 1.1: 1(-1.27,0) 2(1.27,0)
CRYSTAL-SMD_L3.2-W1.5-1
  rect 1.05x1.7 smd: 1(-1.275,0) 2(1.275,0)
F0805
  rect 1.335x1.5 smd: 1(-1.143,0) 2(1.143,0)
HDR-TH_8P-P2.54-V-R2-C4-S2.54_A2541WV-2X4P
  rect 1.8x1.8 hole 1.2: 1(-3.81,-1.27)
  round 1.8 hole 1.2: 2(-3.81,1.27) 3(-1.27,-1.27) 4(-1.27,1.27) 5(1.27,-1.27) 6(1.27,1.27) 7(3.81,-1.27) 8(3.81,1.27)
HDR-TH_10P-P2.54-V-F
  rect 1.575x1.7 hole 1.1: 1(-11.43,0)
  round 1.7 hole 1.1: 2(-8.89,0) 3(-6.35,0) 4(-3.81,0) 5(-1.27,0) 6(1.27,0) 7(3.81,0) 8(6.35,0) 9(8.89,0) 10(11.43,0)
HDR-TH_20P-P2.54-V-F
  rect 1.8x1.8 hole 1.2: 1(-24.13,0)
  round 1.8 hole 1.2: 2(-21.59,0) 3(-19.05,0) 4(-16.51,0) 5(-13.97,0) 6(-11.43,0) 7(-8.89,0) 8(-6.35,0) 9(-3.81,0) 10(-1.27,0) 11(1.27,0) 12(3.81,0) 13(6.35,0) 14(8.89,0) 15(11.43,0) 16(13.97,0) 17(16.51,0) 18(19.05,0) 19(21.59,0) 20(24.13,0)
HDR-TH_22P-P2.54-V-F-R2-C11-S2.54
  rect 1.6x1.6 hole 1.05: 1(-12.7,-1.27)
  round 1.6 hole 1.05: 2(-12.7,1.27) 3(-10.16,-1.27) 4(-10.16,1.27) 5(-7.62,-1.27) 6(-7.62,1.27) 7(-5.08,-1.27) 8(-5.08,1.27) 9(-2.54,-1.27) 10(-2.54,1.27) 11(0,-1.27) 12(0,1.27) 13(2.54,-1.27) 14(2.54,1.27) 15(5.08,-1.27) 16(5.08,1.27) 17(7.62,-1.27) 18(7.62,1.27) 19(10.16,-1.27) 20(10.16,1.27) 21(12.7,-1.27) 22(12.7,1.27)
HDR-TH_30P-P2.54-V-M-R2-C15-S2.54
  rect 1.8x1.575 hole 1.1: 1(-17.78,-1.27)
  round 1.8 hole 1.1: 2(-17.78,1.27) 3(-15.24,-1.27) 4(-15.24,1.27) 5(-12.7,-1.27) 6(-12.7,1.27) 7(-10.16,-1.27) 8(-10.16,1.27) 9(-7.62,-1.27) 10(-7.62,1.27) 11(-5.08,-1.27) 12(-5.08,1.27) 13(-2.54,-1.27) 14(-2.54,1.27) 15(0,-1.27) 16(0,1.27) 17(2.54,-1.27) 18(2.54,1.27) 19(5.08,-1.27) 20(5.08,1.27) 21(7.62,-1.27) 22(7.62,1.27) 23(10.16,-1.27) 24(10.16,1.27) 25(12.7,-1.27) 26(12.7,1.27) 27(15.24,-1.27) 28(15.24,1.27) 29(17.78,-1.27) 30(17.78,1.27)
KEY-SMD_4P-L4.2-W3.2-P2.20-LS4.6
  rect 1.05x0.7 smd: 1(-2.1,1.075) 2(2.1,1.075) 3(-2.1,-1.075) 4(2.1,-1.075)
LED0603-RD
  rect 0.8x0.8 smd: 1(-0.799,-0.004) 2(0.799,0.004)
LQFP-48_L7.0-W7.0-P0.50-LS9.0-BL
  oval 0.27x1.5 smd: 1(-2.75,-4.25) 2(-2.25,-4.25) 3(-1.75,-4.25) 4(-1.25,-4.25) 5(-0.75,-4.25) 6(-0.25,-4.25) 7(0.25,-4.25) 8(0.75,-4.25) 9(1.25,-4.25) 10(1.75,-4.25) 11(2.25,-4.25) 12(2.75,-4.25) 25(2.75,4.25) 26(2.25,4.25) 27(1.75,4.25) 28(1.25,4.25) 29(0.75,4.25) 30(0.25,4.25) 31(-0.25,4.25) 32(-0.75,4.25) 33(-1.25,4.25) 34(-1.75,4.25) 35(-2.25,4.25) 36(-2.75,4.25)
  oval 1.5x0.27 smd: 13(4.25,-2.75) 14(4.25,-2.25) 15(4.25,-1.75) 16(4.25,-1.25) 17(4.25,-0.75) 18(4.25,-0.25) 19(4.25,0.25) 20(4.25,0.75) 21(4.25,1.25) 22(4.25,1.75) 23(4.25,2.25) 24(4.25,2.75) 37(-4.25,2.75) 38(-4.25,2.25) 39(-4.25,1.75) 40(-4.25,1.25) 41(-4.25,0.75) 42(-4.25,0.25) 43(-4.25,-0.25) 44(-4.25,-0.75) 45(-4.25,-1.25) 46(-4.25,-1.75) 47(-4.25,-2.25) 48(-4.25,-2.75)
M3
  round 3.2 hole 3.05: 1(0,0.127)
OPTO-TH_HS0038B-A
  round 1.7 hole 1.1: 1(2.54,0) 2(0,0) 3(-2.54,0)
R0603
  rect 0.806x0.864 smd: 1(-0.753,0) 2(0.753,0)
RES-ADJ-SMD_3P-L3.0-W3.8-P1.75-BR
  rect 1.2x1.2 smd: 1(1.625,-1) 3(1.625,1)
  rect 1.5x1.6 smd: 2(-1.625,0)
SOD-123_L2.8-W1.8-LS3.7-RD
  rect 0.95x1.151 smd: 1(-1.692,0) 2(1.692,0)
SOIC-8_L5.0-W4.0-P1.27-LS6.0-BL
  oval 0.569x1.95 smd: 1(-1.905,-2.705) 2(-0.635,-2.705) 3(0.635,-2.705) 4(1.905,-2.705) 5(1.905,2.705) 6(0.635,2.705) 7(-0.635,2.705) 8(-1.905,2.705)
SOP-8_L4.9-W3.9-P1.27-LS6.0-BL
  oval 0.63x1.865 smd: 1(-1.905,-2.683) 2(-0.635,-2.683) 3(0.635,-2.683) 4(1.905,-2.683) 5(1.905,2.683) 6(0.635,2.683) 7(-0.635,2.683) 8(-1.905,2.683)
SOP-8_L5.0-W4.0-P1.27-LS6.0-BL
  oval 0.574x2.034 smd: 1(-1.905,-2.768) 2(-0.635,-2.768) 3(0.635,-2.768) 4(1.905,-2.768) 5(1.905,2.768) 6(0.635,2.768) 7(-0.635,2.768) 8(-1.905,2.768)
SOP-8_L5.3-W5.2-P1.27-LS7.9-BL
  oval 0.609x2.204 smd: 1(-1.905,-3.542) 2(-0.635,-3.542) 3(0.635,-3.542) 4(1.905,-3.542) 5(1.905,3.542) 6(0.635,3.542) 7(-0.635,3.542) 8(-1.905,3.542)
SOT-23-3_L2.9-W1.3-P0.95-LS2.4-BR
  rect 1.25x0.7 smd: 1(1,-0.95) 2(1,0.95) 3(-1,0)
SOT-23-3_L2.9-W1.3-P1.90-LS2.4-BR
  rect 1.25x0.7 smd: 1(1,-0.95) 2(1,0.95) 3(-1,0)
SOT-23-5_L3.0-W1.7-P0.95-LS2.8-BR
  rect 1x0.6 smd: 1(1.3,-0.95) 2(1.3,0) 3(1.3,0.95) 4(-1.3,0.95) 5(-1.3,-0.95)
SS8050-Y1
  rect 1.069x0.6 smd: 1(1.234,-0.95) 2(1.234,0.95) 3(-1.234,0)
SW-TH_SHOU_MSK22D18G2
  round 1.6 hole 0.8: 1(-2.5,1.675) 2(0,1.675) 3(2.5,1.675) 4(-2.5,-1.675) 5(0,-1.675) 6(2.5,-1.675)
USB-C-SMD_TYPE-C16PIN
  oval 1.001x2.1 hole 0.6x1.7: 1(-4.321,1.788) 2(4.321,1.788)
  oval 1.001x1.801 hole 0.6x1.399: 3(-4.321,-2.362) 4(4.321,-2.362)
  rect 0.6x1.151 smd: A1B12(-3.2,2.362) A4B9(-2.401,2.362) B1A12(3.2,2.362) B4A9(2.401,2.362)
  rect 0.299x1.151 smd: A5(-1.25,2.362) A6(-0.249,2.362) A7(0.249,2.362) A8(-1.75,2.362) B5(1.75,2.362) B6(0.75,2.362) B7(-0.75,2.362) B8(1.25,2.362)

## Nets
3.3V: C8.2 C11.2 H1.7 H2.2 H2.4 H2.6 LDO1.5 R21.2 R22.2 U9.3 U9.7 U9.8 U13.8
GND: C1.2 C2.1 C3.1 C5.1 C6.2 C7.1 C8.1 C9.2 C10.1 C11.1 H1.8 H2.7 H3.4 H3.7 LDO1.2 P1.1 P1.16 P1.20 R2.2 R7.1 R25.1 RP1.1 SW2.4 SW4.4 U1.17 U2.3 U7.2 U9.4 U11.5 U13.1 U13.2 U13.3 U13.4 U13.7 U14.3 U15.2 U16.26 U16.28 U18.10 U19.20 U20.1 U21.1 U22.1 USB1.1 USB1.2 USB1.3 USB1.4 USB1.A1B12 USB1.B1A12
VCC: C1.1 C2.2 C7.2 F1.1 H3.2 H3.5 LDO1.1 LDO1.3 P1.2 P1.15 P1.19 R1.1 R10.2 R18.2 R20.2 R23.2 R24.2 RP1.3 U1.15 U7.3 U11.8 U16.22 U16.24 U18.9 U19.18
VCC_VREF: R20.1 U1.16 U14.1 U14.2
VIN: SW1.3 U15.1 USB1.A4B9 USB1.B4A9
VIN1: Q1.2 R3.2 R4.2 SW1.2 U2.5
DN: U2.2 USB1.A7 USB1.B7
DP: U2.1 USB1.A6 USB1.B6
P00: U1.43 U11.1 U18.1 U19.2
P01: U1.44 U11.4 U18.2 U19.4
P02: H3.3 H3.8 U1.45 U18.3 U19.6
P03: C10.2 H3.1 H3.6 R25.2 U1.46 U18.4 U19.8
P04: U1.47 U18.5 U19.10
P05: U1.2 U18.6 U19.12
P06: U1.3 U18.7 U19.14
P07: U1.4 U18.8 U19.16
P10: R24.1 SW4.2 U1.5 U19.1
P11: R23.1 SW3.2 U1.6 U19.3
P13: R16.1 U1.12 U19.7
P14: R9.1 U1.8 U19.9
P15: U1.9 U19.11
P16: R12.2 U1.10 U19.13
P17: R14.2 U1.11 U19.15
P20: P1.7 U1.33 U16.15
P21: P1.8 U1.34 U16.13
P22: P1.9 U1.35 U9.1 U16.11
P23: P1.10 U1.36 U9.5 U16.9
P24: P1.11 U1.37 U9.2 U16.7
P25: P1.12 U1.38 U9.6 U16.5
P26: H1.4 P1.13 U1.39 U16.3
P27: H1.2 P1.14 U1.40 U16.1
P30: D1.2 U1.19 U16.30
P31: R8.2 U1.20 U16.29
P32: U1.21 U16.27
P33: U1.22 U16.25
P34: U1.23 U16.23
P35: P1.4 U1.26 U16.21
P36: P1.5 U1.27 U16.19
P37: P1.6 U1.28 U16.17
P40: U1.18 U16.16
P41: H1.5 U1.29 U16.14
P42: H1.3 U1.30 U16.12
P43: H1.6 P1.17 U1.31 U16.10
P44: P1.18 R10.1 U1.32 U7.1 U16.8
P45: H1.1 U1.41 U16.6
P46: U1.42 U11.2 U11.3 U16.4 U23.2
P47: U1.7 U19.21 U23.1
P50: U1.24 U16.20
P51: U1.25 U16.18
P52: H2.1 U1.48 U19.17
P53: H2.8 U1.1 U19.19
P54: R18.1 SW2.2 U1.14 U19.5 U19.22
RST#: C4.1 U2.4
VO: P1.3 RP1.2
$1N2753: R2.1 USB1.A5 USB1.B5
$1N3432: C4.2 Q2.1 R3.1
$1N3434: Q1.1 Q2.3 R4.1
$1N3437: F1.2 Q1.3
$1N3959: D1.1 U2.6
$1N3960: R8.1 U2.7
$1N3962: C5.2 U2.8
$1N4389: SW1.5
$1N4442: SW1.6
$1N8715: Q2.2 R7.2
$1N13816: R21.1 U13.6
$1N13839: R22.1 U13.5
$1N15613: SW3.4
$1N19450: C6.1 R12.1 U10.2
$1N19478: C9.1 R14.1 U10.1
$1N22646: C3.2 U1.13
$1N23281: R19.2 U11.7 U12.1
$1N23316: R19.1 U11.6 U12.2
$1N53076: R9.2 U20.2
$1N53304: R16.2 U21.2
$1N53615: R1.2 U22.2

Pads without a net: H2 3 5; LDO1 4; SW1 1 4; SW2 1 3; SW3 1 3; SW4 1 3; U3 1; U4 1; U5 1; U6 1; U16 2; USB1 A8 B8

## Via types
v1: diameter 0.61, hole 0.305, Top Layer to Bottom Layer, 79 vias

## Routing (per net, layer and track width the routed paths; a pad name or vN(x,y) marks a point on that pad's centre or on a via; arc(x,y) is an arc through that point)
3.3V: length 110
  Top Layer w0.254: 42.74,12.38 43.31,11.81 v1(43.31,11.05) ; 42.74,12.38 43.62,12.38 43.82,12.57 43.82,14.09 44.07,14.35 LDO1.5 44.49,14.82 44.2,15.11 v1(43.43,15.11) ; 42.74,12.38 C8.2 ; U9.7 U9.8 34.91,36.56 v1(35.18,36.83) ; v1(48.77,31.24) 48.77,32.7 48.73,32.66 R22.2 46.99,33.93 46.49,34.43 R21.2 44.8,34.71 U13.8 43.08,35.4 v1(43.05,35.43) ; H2.6 H2.4 H2.2 ; v1(29.72,34.03) 29.08,33.4 U9.3
  Bottom Layer w0.254: v1(43.43,15.11) 44.7,15.11 45.21,15.62 45.21,28.95 46.36,30.1 48.26,30.1 48.77,30.6 v1(48.77,31.24) ; H1.7 13.21,46.99 13.59,46.61 13.59,41.78 13.97,41.4 13.97,39.49 14.86,38.6 14.86,36.83 15.24,36.45 19.94,36.45 20.45,35.94 20.45,34.92 20.95,34.41 29.34,34.41 v1(29.72,34.03) 34.54,34.03 35.18,34.67 v1(35.18,36.83) 42.8,36.83 43.05,36.57 v1(43.05,35.43) ; H2.6 54.36,2.92 53.98,3.3 53.98,6.73 53.59,7.11 49.78,7.11 49.28,7.62 49.28,10.03 48.51,10.79 43.56,10.79 v1(43.31,11.05)
GND: length 17.2
  Top Layer w0.254: U13.1 U13.2 U13.3 U13.4 ; 46.23,37.08 44.7,37.08 43.91,36.29 42.2,36.29 41.68,35.77 41.68,34.13 42.38,33.44 U13.7 ; 37.72,24 37.6,23.88 U1.17
  Top Layer w0.6: USB1.B1A12 58.6,28.38 USB1.2 ; USB1.A1B12 58.6,20.89 USB1.1
  vias: v1(6.6,3.55) v1(18.29,37.72) v1(19.05,37.72) v1(19.69,3.55) v1(19.81,37.72) v1(27.3,31.24) v1(28.07,31.24) v1(29.08,16.51) v1(29.08,15.74) v1(31.24,25.14) v1(31.24,24.38) v1(32,25.14) v1(32,24.38) v1(35.69,20.55) v1(35.69,19.82) v1(35.69,19.05) v1(36.83,16.63) v1(37.08,36.19) v1(37.72,14.86) v1(37.84,36.19) v1(38.35,24.25) v1(38.99,26.79) v1(39.2,24.25) v1(44.45,17.14) v1(46.99,17.14)
VCC: length 254.7
  Top Layer w0.254: R18.2 5.72,1.77 6.1,1.39 11.68,1.39 ; RP1.3 64.01,40.39 v1(64.01,39.11) ; R23.2 11.31,1.77 11.68,1.39 ; H3.5 17.53,14.22 16.89,14.86 13.33,14.86 12.45,15.74 H3.2 12.66,16.34 U11.8 13.95,31.6 14.48,32.13 14.48,38.1 13.74,38.83 11.33,38.83 10.16,40 ; 48.39,15.24 48.39,13.64 ; 48.39,15.24 48.89,15.74 48.89,16.25 51.18,16.25 51.44,16.51 F1.1 ; 48.39,15.24 48.39,15.36 ; 48.39,13.64 48.21,13.46 ; 48.39,13.64 48.39,13.51 ; F1.1 51.3,17.53 ; F1.1 v1(51.44,19.81) ; v1(55.37,26.16) 55.37,27.31 55.62,27.56 R1.1 ; P1.15 20.19,40.64 20.19,42.03 19.69,42.54 10.92,42.54 10.16,41.78 P1.19 10.16,40 ; U19.18 44.6,8.2 U18.9 44.55,11.65 44.49,11.71 ; 44.49,11.71 44.49,12.35 44.83,12.7 46.1,12.7 46.36,12.44 46.36,11.94 46.59,11.7 46.88,11.7 47.12,11.94 47.12,13.08 47.63,13.59 48.21,13.59 ; 44.49,11.71 44.49,11.5 ; C1.1 41.39,19.76 C2.2 42.1,19.05 43.05,19.05 43.31,18.79 43.31,16.76 43.81,16.26 R20.2 ; 11.68,1.39 17.32,1.39 ; 17.32,1.39 22.1,1.39 22.61,0.89 v1(30.73,0.89) ; 17.32,1.39 16.9,1.82 R24.2 ; U1.15 39.34,22.88 39.62,22.6 39.62,19.84 39.55,19.76 ; 10.16,40 9.02,38.86 4.57,38.86 3.56,39.87 R10.2 3.56,41.66 3.94,42.03 4.6,42.03 4.83,42.26 U7.3 4.83,45.21 5.84,46.22 10.16,46.22 10.54,46.61 10.54,48.38 11.18,49.02 48.01,49.02 48.26,48.77 U16.22 U16.24
  Bottom Layer w0.254: U16.24 50.32,47.01 49.53,46.22 49.53,39.49 49.91,39.11 52.09,39.11 52.98,40 53.34,40 ; P1.2 53.34,40.13 ; 53.34,40.13 53.7,40.13 54.84,38.99 63.88,38.99 v1(64.01,39.11) ; 53.34,40.13 53.34,40 ; U19.18 43.31,4.16 43.31,1.52 42.67,0.89 v1(30.73,0.89) ; 53.34,40 53.34,26.67 53.85,26.16 v1(55.37,26.16) 55.37,20.44 54.74,19.81 v1(51.44,19.81)
VCC_VREF: length 17.3
  Top Layer w0.254: U1.16 35.51,23.36 39.5,23.36 40.13,22.73 40.13,21.08 40.51,20.7 43.56,20.7 43.82,20.44 43.82,19.67 44.07,19.41 U14.2 U14.1 46.67,18.48 47.38,17.77 48.51,17.77
VIN: length 30.3
  Top Layer w0.254: USB1.A4B9 58.61,22.22 59.3,22.22 60.71,23.63 60.71,25.64 59.31,27.04 USB1.B4A9
  Top Layer w0.4: 61.47,16.19 61.47,18.67 61.09,19.05 57.53,19.05 57.15,19.43 57.15,21.84 57.54,22.23 USB1.A4B9 ; U15.1 57.15,35.94 56.52,35.3 56.52,32.45 57.3,31.66 57.3,27.58 57.84,27.04 USB1.B4A9
VIN1: length 25
  Top Layer w0.254: 59.24,13.6 59.18,13.66 59.18,14.35 58.93,14.6 57.28,14.6 56.77,15.11 R3.2 55.63,15.12 55.63,15.62 55.25,16 53.09,16 52.58,16.51 52.58,20.7 52.07,21.21 46.48,21.21 45.97,21.71 U2.5
  Top Layer w0.4: 59.37,13.6 61.59,13.6 61.7,13.71 ; 59.24,13.6 59.24,12.13 R4.2
DN: length 15.8
  Top Layer w0.254: USB1.A7 59.35,24.88 59.56,24.67 59.56,24.13 59.31,23.87 58.61,23.87 USB1.B7 58.58,23.87 57.4,23.87 57.15,24.13 57.15,24.76 56.92,24.99 50.44,24.99 48.51,26.92 U2.2
DP: length 13.9
  Top Layer w0.254: USB1.A6 57.78,24.39 57.66,24.51 57.66,25.14 57.9,25.38 USB1.B6 58.58,25.4 50.67,25.4 49.78,26.29 U2.1
P00: length 36.8
  Top Layer w0.254: 24,5.46 24.23,5.68 U18.1 24.23,22.83 25.77,24.38 26.99,24.38 U1.43 28.58,24.38 v1(28.7,24.51) ; U11.1 18.09,31.62 21.84,31.62 23.11,30.35 v1(23.11,29.33)
  Bottom Layer w0.254: v1(23.11,29.33) 23.47,29.33 28.3,24.51 v1(28.7,24.51)
P01: length 41.8
  Top Layer w0.254: v1(29.34,25.14) 29.34,24.25 28.97,23.88 U1.44 26.98,23.87 25.84,23.87 24.64,22.67 24.64,10.74 26.77,8.61 U18.2 26.77,5.68 26.54,5.46 ; U11.4 18.94,35.41 19.43,34.92 19.43,33.27 20.07,32.64 v1(22.48,32.64)
  Bottom Layer w0.254: v1(22.48,32.64) 22.48,31.11 28.32,25.27 29.21,25.27 v1(29.34,25.14)
P02: length 47.4
  Top Layer w0.254: v1(30.1,22.73) 29.44,23.38 U1.45 25.93,23.38 25.04,22.5 25.04,11.09 26.61,9.52 27.56,9.52 27.81,9.27 28.83,9.27 29.31,8.79 U18.3 29.34,8.22 29.34,5.66
  Bottom Layer w0.254: H3.3 15.85,14.45 16.48,14.45 16.89,14.86 18.8,14.86 H3.8 20.19,16.25 20.19,20.7 20.7,21.21 29.34,21.21 30.1,21.97 v1(30.1,22.73)
P03: length 53.1
  Top Layer w0.254: H3.1 12.37,13.51 C10.2 9.97,13.56 R25.2 ; v1(29.08,22.73) 28.93,22.88 U1.46 26,22.88 25.45,22.33 25.45,11.26 26.78,9.93 30.84,9.93 31.85,8.92 U18.4 31.85,5.68 31.62,5.46
  Bottom Layer w0.254: v1(29.08,22.73) 29.08,22.22 28.47,21.61 20.53,21.61 19.79,20.87 19.79,18.01 19.05,17.27 18.03,17.27 17.53,16.76 H3.6 17.53,16.07 16.32,14.86 13.72,14.86 H3.1
P04: length 25.2
  Top Layer w0.254: U1.47 26.08,22.38 25.85,22.16 25.85,11.43 26.95,10.33 31.06,10.33 31.88,9.52 33.91,9.52 34.39,9.04 U18.5 34.39,5.68 34.16,5.46
P05: length 22.6
  Top Layer w0.254: U1.2 28.99,19.34 27.69,18.03 27.69,12.69 28.77,11.6 31.7,11.6 32.13,11.17 34.67,11.17 36.93,8.92 U18.6 36.93,5.68 36.7,5.46
P06: length 24.9
  Top Layer w0.254: 39.24,5.46 39.47,5.68 U18.7 39.5,8.28 39.5,9.27 39.12,9.65 36.89,9.65 34.96,11.58 32.49,11.58 32.05,12.01 28.94,12.01 28.09,12.86 28.09,17.8 29.49,19.2 U1.3
P07: length 26.9
  Top Layer w0.254: U1.4 29.99,19 28.5,17.51 28.5,13.03 29.11,12.42 32.28,12.42 32.72,11.99 35.13,11.99 37.06,10.06 39.34,10.06 40.01,9.39 41.78,9.39 42.04,9.14 42.04,8.28 U18.8 42.01,5.68 41.78,5.46
P10: length 33
  Top Layer w0.254: R24.1 18.57,4.23 ; 18.57,4.23 18.61,4.27 SW4.2 ; 18.57,4.23 21.86,4.23 22.35,3.74 22.35,3.17 22.61,2.92 U19.1 ; v1(29.34,17.27) 29.34,17.77 30.49,18.93 U1.5
  Bottom Layer w0.254: U19.1 25.15,2.92 25.53,3.3 25.53,9.27 25.78,9.52 27.3,9.52 28.07,10.28 28.83,10.28 29.69,11.15 29.69,16.91 v1(29.34,17.27)
P11: length 41.3
  Top Layer w0.254: 12.85,4.23 13.29,4.23 14.1,3.43 v1(14.1,2.03) ; 12.85,4.23 13.02,4.4 SW3.2 ; 12.85,4.23 R23.1 ; U1.6 30.99,19.04 v1(31.11,18.92)
  Bottom Layer w0.254: v1(31.11,18.92) 31.11,18.54 30.1,17.52 30.1,10.98 29,9.88 28.3,9.88 27.94,9.52 27.94,3.3 27.56,2.92 U19.3 26.82,1.93 26.54,1.65 14.48,1.65 v1(14.1,2.03)
P13: length 49.3
  Top Layer w0.254: U1.12 33.99,21.61 33.63,21.97 v1(32.39,21.97) ; v1(12.19,6.47) 11.44,5.72 R16.1 ; v1(21.97,2.41) 21.97,2.16 22.73,1.39 30.38,1.39 U19.7
  Bottom Layer w0.254: v1(32.39,21.97) 32,21.59 32,18.85 30.51,17.35 30.51,3.65 31.24,2.92 U19.7 ; v1(21.97,2.41) 14.99,2.41 14.1,3.3 14.1,6.22 13.84,6.47 v1(12.19,6.47)
P14: length 42
  Top Layer w0.254: v1(31.5,17.4) 31.99,17.89 U1.8 ; R9.1 17.53,5.85 17.91,6.22 17.91,7.74 18.03,7.87 19.43,7.87 19.56,7.74 19.56,5.33 20.07,4.82 21.84,4.82 22.61,4.06 33.3,4.06 U19.9
  Bottom Layer w0.254: v1(31.5,17.4) 31.5,11.3 33.15,9.65 33.15,3.55 33.78,2.92 U19.9
P15: length 21.1
  Top Layer w0.254: v1(32.39,17.27) 32.49,17.38 U1.9
  Bottom Layer w0.254: v1(32.39,17.27) 31.9,16.79 31.9,11.47 33.47,9.9 35.05,9.9 35.8,9.16 35.8,3.44 36.32,2.92 U19.11
P16: length 23.9
  Top Layer w0.254: U1.10 32.99,16.41 v1(33.02,16.38) 32.76,16.12 R12.2
  Bottom Layer w0.254: U19.13 38.61,2.92 38.23,3.3 38.23,10.41 37.87,10.77 36.03,10.77 35.03,11.77 35.03,15.9 34.54,16.38 v1(33.02,16.38)
P17: length 25.2
  Top Layer w0.254: R14.2 33.78,16.88 v1(33.78,17.4) 33.49,17.69 U1.11
  Bottom Layer w0.254: U19.15 41.27,2.92 40.77,3.43 40.77,9.14 40.39,9.52 39.69,9.52 38.04,11.17 36.2,11.17 35.43,11.94 35.43,16.76 34.8,17.4 v1(33.78,17.4)
P20: length 24.1
  Top Layer w0.254: U16.15 P1.7 40.64,39.62 40.26,39.24 38.48,39.24 38.04,38.8 35.51,38.8 35.13,38.43 33.68,38.43 33.27,38.02 31.99,38.02 31.7,37.73 31.7,32 29.99,30.3 U1.33
P21: length 22.2
  Top Layer w0.254: U1.34 29.49,30.37 31.29,32.17 31.29,37.89 31.83,38.43 33.1,38.43 33.51,38.83 34.97,38.83 35.34,39.21 37.81,39.21 38.1,39.49 P1.8 U16.13
P22: length 32.6
  Top Layer w0.254: U9.1 27.05,35.94 26.31,35.2 26.31,28.17 26.67,27.81 28.83,27.81 28.99,27.97 U1.35 28.99,30.45 30.89,32.34 30.89,38.06 31.66,38.83 32.93,38.83 33.34,39.24 34.8,39.24 35.56,40 P1.9 U16.11
P23: length 31.1
  Top Layer w0.254: v1(27.69,29.21) 28.17,29.21 U1.36 28.49,30.52 30.48,32.51 30.48,38.23 31.49,39.24 32.77,39.24 33.02,39.49 P1.10 U16.9 ; v1(35.81,31.37) 35.05,32.13 U9.5
  Bottom Layer w0.254: v1(27.69,29.21) 27.69,28.7 27.91,28.47 29.25,28.47 29.53,28.19 32.77,28.19 33.1,28.52 33.1,29.42 34.72,31.04 35.48,31.04 v1(35.81,31.37)
P24: length 28.5
  Top Layer w0.254: 30.15,39.37 28.6,39.37 28.35,39.11 28.35,38.69 27.85,38.2 26.39,38.2 25.91,37.72 25.91,27.68 26.21,27.38 U1.37 ; 30.15,39.37 29.97,39.19 29.97,35.05 29.59,34.67 U9.2 ; 30.15,39.37 30.35,39.37 30.48,39.49 P1.11 U16.7
P25: length 45
  Top Layer w0.254: v1(36.32,32.76) 35.69,33.4 U9.6 ; 24.13,48.26 24.13,46.35 24.77,45.72 26.7,45.72 U16.5 P1.12 27.94,38.86 27.69,38.6 25.91,38.6 25.5,38.2 25.5,27.33 25.94,26.88 U1.38 28.23,26.88 28.7,26.41 v1(28.7,26.16)
  Bottom Layer w0.254: v1(36.32,32.76) 36.45,32.64 36.45,30.98 36.09,30.63 34.88,30.63 33.5,29.25 33.5,26.03 33.25,25.78 29.08,25.78 v1(28.7,26.16)
P26: length 28.9
  Top Layer w0.254: U1.39 25.87,26.38 25.1,27.16 25.1,40.2 P1.13 U16.3 25.12,44.47 23.88,45.72 18.29,45.72 17.4,44.83 H1.4
P27: length 24.5
  Top Layer w0.254: U1.40 25.79,25.88 24.69,26.99 24.69,38.3 24.38,38.6 23.37,38.6 22.86,39.11 P1.14 U16.1 22.83,44.45 H1.2
P30: length 43.7
  Top Layer w0.254: U1.19 40.98,24.88 D1.2 42.42,24.63 43.43,25.65 43.43,28.83 44.3,29.69 51.22,29.69 52.07,30.54 52.07,35.81 52.68,36.42 55.03,36.42 56.81,38.2 57.83,38.2 58.83,39.2 58.83,42.69 59.69,43.56 59.69,46.73 59.41,47.01 U16.30
P31: length 38.2
  Top Layer w0.254: U1.20 39.48,25.38 40.26,26.16 42.29,26.16 42.93,26.79 42.93,28.95 44.07,30.1 51.05,30.1 51.56,30.6 51.56,35.88 52.51,36.83 54.86,36.83 56.64,38.6 57.66,38.6 58.42,39.37 U16.29
P32: length 34.8
  Top Layer w0.254: U1.21 36.56,25.88 37.85,27.17 37.85,27.81 38.07,28.04 39.73,28.04 39.75,28.06 39.96,28.06 41.27,29.38 41.27,35.94 42.04,36.7 43.51,36.7 44.4,37.59 45.99,37.59 46.45,38.05 48.73,38.05 49.51,38.83 51.92,38.83 52.32,39.24 54.23,39.24 54.61,39.62 54.61,43.94 55.14,44.47 U16.27
P33: length 32.2
  Top Layer w0.254: U16.25 52.48,44.47 52.07,44.07 52.07,39.62 51.69,39.24 49.34,39.24 48.56,38.46 46.28,38.46 45.82,38 44.23,38 43.35,37.11 41.87,37.11 40.87,36.11 40.87,29.55 39.79,28.47 37.87,28.47 37.34,27.94 37.34,27.24 36.49,26.38 U1.22
P34: length 29.2
  Top Layer w0.254: U1.23 36.41,26.88 36.83,27.3 36.83,28 37.7,28.88 39.62,28.88 40.46,29.72 40.46,36.27 41.7,37.51 43.18,37.51 44.07,38.4 45.65,38.4 46.11,38.86 48.39,38.86 49.53,40 49.53,43.94 50.06,44.47 U16.23
P35: length 29.3
  Top Layer w0.254: U1.26 33.49,29.81 33.98,30.3 34.84,30.3 35.86,29.28 39.45,29.28 40.06,29.89 40.06,36.44 41.53,37.92 43.01,37.92 43.9,38.81 45.48,38.81 45.94,39.27 47.91,39.27 48.26,39.62 P1.4 U16.21
P36: length 27.5
  Top Layer w0.254: U1.27 32.99,30.18 33.52,30.71 35.01,30.71 36.03,29.69 39.28,29.69 39.65,30.05 39.65,36.61 41.36,38.33 42.84,38.33 43.73,39.21 45.31,39.21 45.72,39.62 P1.5 U16.19
P37: length 25.6
  Top Layer w0.254: U1.28 32.49,30.26 33.35,31.11 35.18,31.11 36.2,30.1 38.99,30.1 39.24,30.35 39.24,36.78 41.2,38.73 42.67,38.73 43.18,39.24 P1.6 U16.17
P40: length 35.7
  Top Layer w0.254: U1.18 34.16,24.38 33.91,24.63 v1(33.91,25.14)
  Bottom Layer w0.254: U16.16 41.25,47.01 41.91,46.35 41.91,39.49 42.42,38.99 43.69,38.99 44.04,38.63 44.04,30.83 43.43,30.22 35.05,30.22 33.91,29.08 v1(33.91,25.14)
P41: length 47.9
  Top Layer w0.254: v1(34.29,36.95) 34.16,36.95 33.05,35.84 33.05,31.38 32,30.34 32,28.9 U1.29
  Bottom Layer w0.254: v1(34.29,36.95) 34.29,38.28 35.12,39.11 36.45,39.11 36.83,39.49 36.83,46.61 37.24,47.01 U16.14 38.1,47.88 37.72,48.26 36.07,48.26 35.66,48.66 28.43,48.66 28.02,49.07 20.5,49.07 20.19,48.77 18.6,48.77 18.09,48.26 15.37,48.26 14.86,47.75 H1.5
P42: length 40.5
  Top Layer w0.254: U1.30 31.49,30.41 32.64,31.55 32.64,36.45 33.4,37.21 v1(33.4,37.33)
  Bottom Layer w0.254: H1.3 18.67,48.26 20.38,48.26 20.79,48.66 27.85,48.66 28.26,48.26 35.43,48.26 35.56,48.13 U16.12 34.7,47.01 34.29,46.61 34.29,38.86 33.4,37.97 v1(33.4,37.33)
P43: length 51.7
  Top Layer w0.254: v1(23.24,32.38) 23.47,32.61 23.47,33.8 22.48,34.8 22.48,38.1 21.46,39.11 16.2,39.11 15.24,40.07 P1.17 ; v1(32.51,37.33) 32.13,36.95 32.13,31.62 30.99,30.48 U1.31 30.99,27.43 v1(30.35,26.79)
  Bottom Layer w0.254: v1(30.35,26.79) 27.56,26.79 23.24,31.11 v1(23.24,32.38) ; H1.6 14.61,44.19 14.61,41.14 P1.17 ; U16.10 32.87,46.86 32,46.86 31.75,46.61 31.75,38.73 32.51,37.97 v1(32.51,37.33)
P44: length 62.8
  Top Layer w0.254: P1.18 12.7,39.88 13.33,39.24 15.49,39.24 16.03,38.71 21.29,38.71 21.84,38.16 v1(21.84,35.3) 21.84,34.29 v1(22.48,33.65) ; U1.32 30.49,27.69 30.23,27.43 v1(29.59,27.43) ; R10.1 5.33,41.27 5.33,42.91 5.72,43.3 9.65,43.3 9.91,43.56 U7.1
  Bottom Layer w0.254: U16.8 29.21,45.74 29.21,35.68 28.35,34.82 22.33,34.82 v1(21.84,35.3) ; U7.1 9.91,42.54 10.41,42.03 12.32,42.03 12.7,41.65 P1.18 ; v1(29.59,27.43) 27.56,27.43 24,30.98 24,33.02 23.37,33.65 v1(22.48,33.65)
P45: length 36.3
  Top Layer w0.254: U1.41 25.72,25.38 24.28,26.82 24.28,36.8 v1(24,37.08)
  Bottom Layer w0.254: v1(24,37.08) 24,38.48 24.51,38.99 26.04,38.99 26.67,39.62 26.67,46.35 27.33,47.01 U16.6 27.94,48 27.69,48.26 20.95,48.26 19.94,47.24 H1.1
P46: length 39.5
  Top Layer w0.254: 25.64,24.88 21.47,24.88 U23.2 ; 25.64,24.88 U1.42 ; 25.64,24.88 23.88,26.65 23.88,30.98 ; v1(23.37,36.06) 23.37,35.94 23.88,35.43 23.88,30.98 ; U11.3 U11.2 19.07,32.87 19.81,32.13 21.91,32.13 23.05,30.98 23.88,30.98
  Bottom Layer w0.254: U16.4 24.66,47.01 24.13,46.48 24.13,39.49 23.37,38.73 v1(23.37,36.06)
P47: length 49.5
  Top Layer w0.254: U23.1 20.7,23.62 21.34,24.25 v1(23.88,24.25) ; U1.7 31.49,22.22 31.88,22.6 v1(33.15,22.6)
  Bottom Layer w0.254: v1(23.88,24.25) 27.81,24.25 28.32,23.75 32.89,23.75 33.15,23.49 v1(33.15,22.6) 34.42,21.33 34.42,18.35 35.84,16.93 35.84,12.1 36.36,11.58 38.21,11.58 39.86,9.93 40.55,9.93 40.93,9.56 42.64,9.56 43.31,8.89 43.31,7.24 43.82,6.73 45.34,6.73 45.85,6.22 45.85,4.7 46.36,4.19 49.02,4.19 49.68,3.53 U19.21
P50: length 30.2
  Top Layer w0.254: U1.24 35.49,27.87 v1(36.2,28.57)
  Bottom Layer w0.254: v1(36.2,28.57) 37.03,29.41 43.77,29.41 44.86,30.5 44.86,38.6 45.24,38.99 46.48,38.99 46.99,39.49 46.99,46.73 46.71,47.01 U16.20
P51: length 28.5
  Top Layer w0.254: U1.25 34.19,29.08 v1(34.92,29.08)
  Bottom Layer w0.254: v1(34.92,29.08) 35.66,29.82 43.6,29.82 44.45,30.66 44.45,46.48 43.92,47.01 U16.18
P52: length 55.3
  Top Layer w0.254: U1.48 26.33,21.88 26.26,21.81 26.26,11.6 27.06,10.79 31.24,10.79 32.11,9.93 34.65,9.93 35.69,8.89 35.69,4.82 36.45,4.06 43.31,4.06 44.45,2.92 U19.17 44.6,2.13 45.36,1.37 53.57,1.37 53.98,1.77 53.98,3.68 54.48,4.19 59.69,4.19 60.33,4.82 H2.1
P53: length 45.4
  Top Layer w0.254: v1(33.78,10.54) 33.66,10.41 32.26,10.41 31.47,11.2 28.6,11.2 27.28,12.52 27.28,18.2 28.49,19.41 U1.1 ; v1(33.78,12.57) 35.18,12.57 37.21,10.54 39.5,10.54 40.23,9.8 42.52,9.8 43.31,9.01 43.31,4.64 43.75,4.19 46.86,4.19 47.14,3.91 U19.19 48.29,1.77 52.45,1.77 52.7,2.03 H2.8
  Bottom Layer w0.254: v1(33.78,12.57) v1(33.78,10.54)
P54: length 90
  Top Layer w0.254: U1.14 34.25,22.38 v1(34.04,22.6) ; v1(8.51,2.03) 8.51,3.68 7.95,4.23 R18.1 ; v1(40.77,2.16) 41.15,1.77 44.38,1.77 45.4,0.76 v1(51.31,0.76) ; 7.43,6.95 7.36,6.88 7.36,6.24 7.11,5.99 5.97,5.99 5.72,5.73 5.72,4.38
  Bottom Layer w0.254: v1(40.77,2.16) 40.77,2.03 40.39,1.65 30.63,1.65 U19.5 27.69,1.24 13.61,1.24 13.33,1.52 9.02,1.52 v1(8.51,2.03) ; v1(34.04,22.6) 34.82,21.82 34.82,18.52 36.25,17.1 36.25,12.27 36.53,11.99 38.38,11.99 40.03,10.33 40.72,10.33 41.1,9.96 42.81,9.96 43.28,9.49 45.37,9.49 45.85,9.01 45.85,7.49 46.61,6.73 48.41,6.73 U19.22 50.93,5.46 51.44,4.95 51.44,0.89 v1(51.31,0.76)
RST#: length 19.9
  Top Layer w0.254: v1(45.97,26.41) U2.4 ; C4.1 51.82,13.84 v1(51.05,14.6)
  Bottom Layer w0.254: v1(45.97,26.41) 45.97,15.49 46.86,14.6 v1(51.05,14.6)
VO: length 14.1
  Top Layer w0.254: v1(60.96,42.92) 61.7,43.66 RP1.2
  Bottom Layer w0.254: P1.3 50.8,41.53 51.44,42.16 60.2,42.16 v1(60.96,42.92)
$1N2753: length 8.2
  Top Layer w0.254: R2.1 57.02,22.98 57.4,23.36 58.58,23.36 USB1.A5 59.71,23.39 60.3,23.97 60.3,25.47 59.38,26.38 USB1.B5
$1N3432: length 6.5
  Top Layer w0.254: C4.2 52.02,10.95 Q2.1 54.11,11.02 R3.1
$1N3434: length 4.2
  Top Layer w0.254: R4.1 57.54,13.41 Q1.1 55.17,13.6 Q2.3
$1N3437: length 5.9
  Top Layer w0.254: Q1.3 58.29,16.63 57.53,17.4 F1.2
$1N3959: length 4.6
  Top Layer w0.254: U2.6 47.24,24.38 46.99,24.63 44.36,24.63
$1N3960: length 6.9
  Top Layer w0.254: R8.1 44.96,26.54 45.21,26.29 45.21,25.65 45.82,25.04 47.22,25.04 47.88,24.38 47.88,23.75 48.51,23.11 U2.7
$1N3962: length 1.7
  Top Layer w0.254: U2.8 51.34,22.76 C5.2
$1N8715: length 1.8
  Top Layer w0.254: R7.2 55.94,9.58 Q2.2
$1N13816: length 2.6
  Top Layer w0.254: 45.08,32.93 45.08,32.41 44.84,32.17 U13.6
$1N13839: length 4
  Top Layer w0.254: R22.1 43.33,31.15 U13.5
$1N19450: length 2.1
  Top Layer w0.254: U10.2 31.61,13.89 C6.1
$1N19478: length 2
  Top Layer w0.254: U10.1 34.8,13.89 C9.1
$1N22646: length 3.1
  Top Layer w0.254: C3.2 37.34,21.46 36.91,21.88 U1.13
$1N23281: length 4.8
  Top Layer w0.254: U11.7 10.89,32.87 10.75,32.73 ; 10.75,32.73 9.24,32.73 8.51,32 ; 10.75,32.73 10.94,32.73 ; 10.75,32.73 R19.2
$1N23316: length 4.3
  Top Layer w0.254: U11.6 12.65,34.15 R19.1 8.81,34.15 ; 8.51,34.54 8.81,34.24
$1N53076: length 2.4
  Top Layer w0.254: R9.2 16.89,7.36 16.89,8.25 16.76,8.38 16.26,8.38 16.05,8.59 U20.2
$1N53304: length 2.6
  Top Layer w0.254: U21.2 10.46,8.59 10.67,8.38 11.18,8.38 11.3,8.25 11.3,7.23 R16.2
$1N53615: length 1.9
  Top Layer w0.254: U22.2 53.86,29.41 R1.2

## Copper pours and planes (outline as drawn; the poured copper is in the pictures)
GND on Top Layer: -3.81,52.7 96.19,52.7 96.19,-32.77 -3.81,-32.77
GND on Bottom Layer: -9.14,55.75 99.7,55.75 99.7,-38.48 -9.14,-38.48

## Text on the board
Bottom Silkscreen Layer: 背光 | VCC | GND | P44 | OLED | 3.3V | P43 | P41 | P42 | P26 | P27 | P45 | X | P46 | P25 | P24 | P23 | P22 | P21 | P40 | P20 | P51 | P37 | P50 | P36 | P35 | VO | P34 | P33 | P32 | P30 | P31 | P03 | P02 | P00 | P10 | P01 | P11 | P12 | P13 | P14 | P04 | P15 | P05 | P16 | P06 | P17 | P07 | P52 | P53 | P54 | P47 | 红外: / P44 | 按键:P10，P11，P54 | LED:P14，P13 | LCD1602/12864 | + | ESP-01 | Max:8V | ADC:P0,P1,P54(P12) / P07为内部测试电压(1.19V) | PWMP(偶数): / P1,P2,P6 / PWMN(奇数): / P1,P2,P6 | 电源 / 开关 | 外部电源 | - | V1.0
Top Silkscreen Layer: W25X16 | ADC/IIC | 3.3V压降 | 滤波 | CH340N | 基准 | 电源 | 外部 / 供电 | 冷启动 | 背光 | 红外 / 接收 | 485电路 | 按钮&LED | 串口2 | SP3485 | VCC | GND | P44 | P03 | P02 | P00 | P10 | P01 | P11 | P12 | P13 | P04 | P14 | P05 | P15 | P06 | P16 | P07 | P17 | P52 | P53 | P54 | P47 | 3.3V | X | 8266 | P41 | P43 | P42 | P26 | P45 | P27 | OLED | P46 | P25 | P24 | P23 | P22 | P21 | P40 | P20 | P51 | P37 | P50 | P36 | P35 | VO | P34 | P33 | P32 | P30 | P31 | Rx:P46 Tx:P47 | 开 | 关 | A | B | Rx | Tx | 外部 / 晶振 | + | V1.0 | STC / 8H/32G | -
